# EAGLE design Pow_bank (EAGLE 7.7.0)
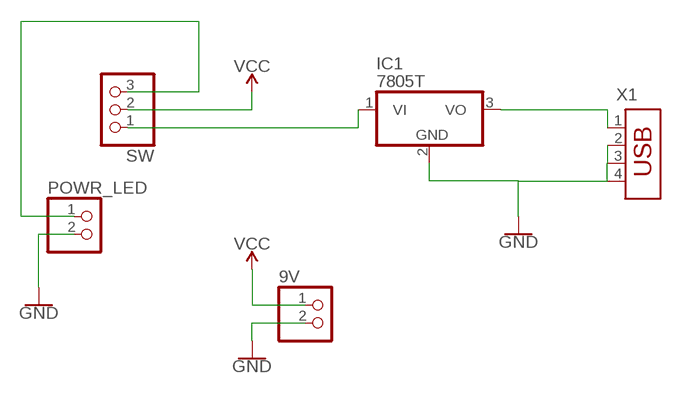
[diagram p0: schematic, sheet 1]

## Parts
9V  PINHD-1X2  [1X02]
IC1  7805T  [TO220H]
POWR_LED  PINHD-1X2  [1X02]
SW  PINHD-1X3  [1X03]
X1  USB-787616  [USB]

## Nets
GND: 9V.2 IC1.2(GND) POWR_LED.2 X1.2 X1.3 X1.4
N$1: IC1.1(VI) SW.1
N$2: IC1.3(VO) X1.1
N$3: POWR_LED.1 SW.3
VCC: 9V.1 SW.2

## Library data of the parts
9V POWR_LED = pinhead:PINHD-1X2: PIN HEADER
IC1 = linear:78*: Positive VOLTAGE REGULATOR Source: http://cache.national.com/ds/LM/LM78L05.pdf http://www.fairchildsemi.com/ds/LM/LM7805.pdf
SW = pinhead:PINHD-1X3: PIN HEADER
X1 = con-amp:USB-787616: AMP connector

## Board
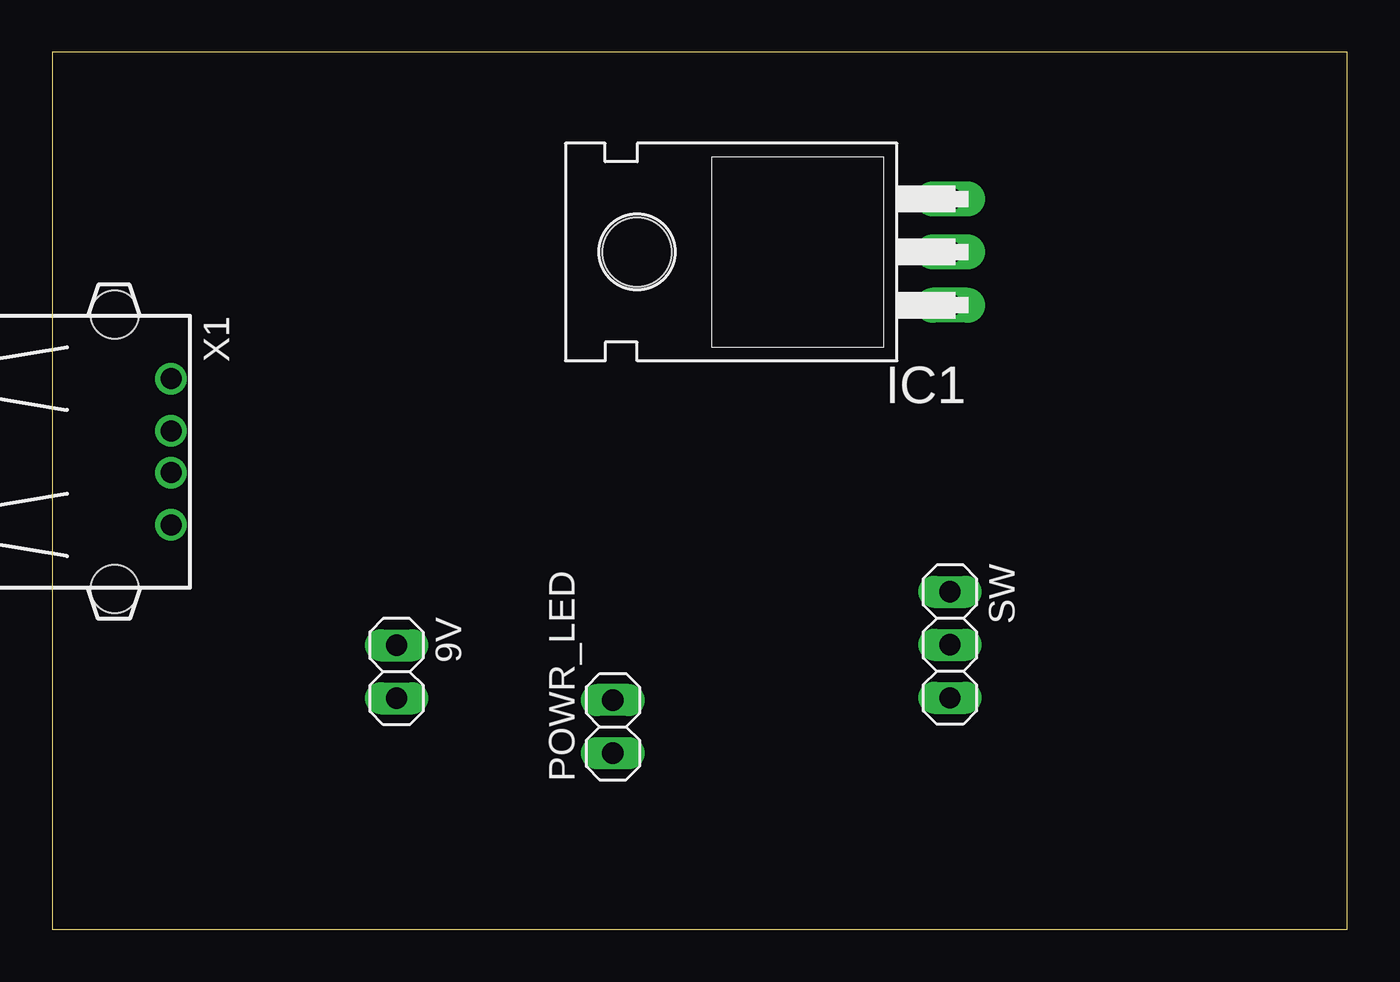
[diagram p1: board, top side]
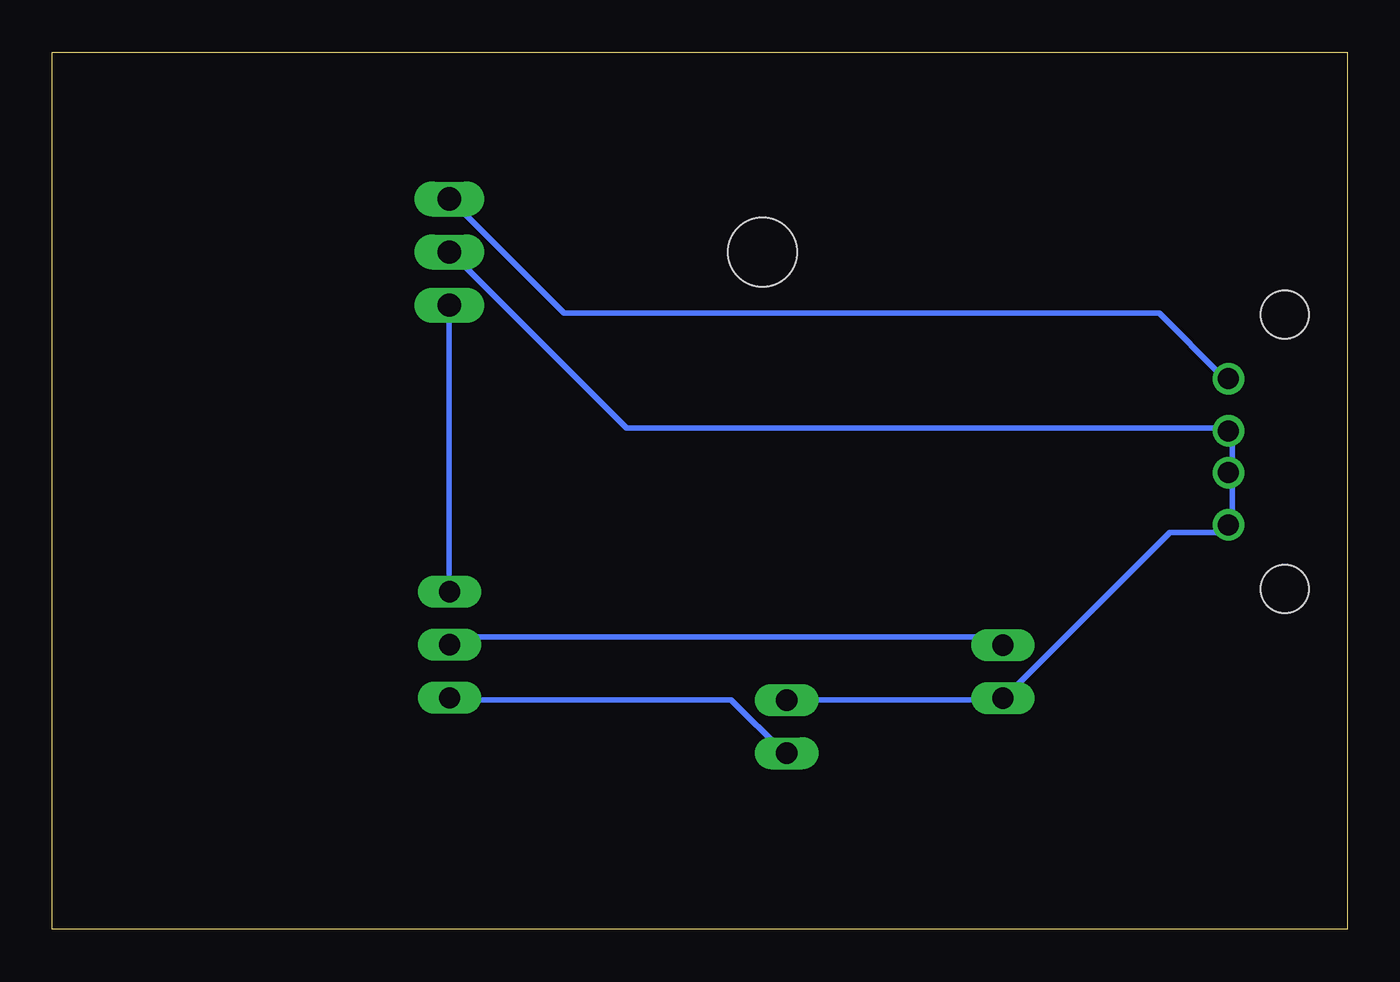
[diagram p2: board, bottom side, seen from below]

Size 62 x 42 mm. Coordinates in mm from the lower left corner, seen from the top.
Outline: 0,0 62,0 62,42 0,42 0,0
Copper layers (1*16): Top 0.035mm / dielectric 1.5mm / Bottom 0.035mm
Design rules "default": minimum track width 10mil, minimum drill 24mil, track to track 8mil, track to pad 8mil, pad to pad 8mil, via to via 8mil, smd to smd 8mil, copper to edge 40mil, drill to drill 8mil, minimum pad ring 10mil, minimum via ring 8mil, stop-mask expansion 4mil, vias tented up to drill 0mil, thermal gap 10mil

### Footprints (pad centres in the part's own frame; a part is rotated, then mirrored left to right if it is on the bottom)
1X02 = drill 1.016 long: 1 -1.27,0; 2 1.27,0
TO220H = drill 1.118 long: 1 -2.54,-10.16; 2 0,-10.16; 3 2.54,-10.16 | hole 3.302: 0,4.826
1X03 = drill 1.016 long: 1 -2.54,0; 2 0,0; 3 2.54,0
USB = drill 1: 1 -3.5,12.99; 2 -1,12.99; 3 1,12.99; 4 3.5,12.99 | hole 2.3: -6.57,10.28; 6.57,10.28

### Placement (x,y rotation side)
9V  16.48,12.34 270 top
IC1  32.82,32.43 90 top
POWR_LED  26.84,9.71 90 top
SW  42.98,13.63 270 top
X1  -7.3,22.87 270 top

### Tracks (layer width: path | path; a pad name or v marks a point on that pad's centre or on a via)
GND
  Bottom 0.254: POWR_LED.2 26.5,11 16.5,11 9V.2 16,11.5 8.5,19 6,19 X1.4 5.5,19.5 5.5,21.5 X1.3 5.5,22 5.5,23.5 X1.2 6,24 34.5,24 42.5,32 IC1.2
N$1
  Bottom 0.254: SW.1 43,16.5 43,29.5 IC1.1
N$2
  Bottom 0.254: X1.1 6,26.5 9,29.5 37.5,29.5 42.5,34.5 IC1.3
N$3
  Bottom 0.254: POWR_LED.1 27,8.5 29.5,11 42.5,11 SW.3
VCC
  Bottom 0.254: 9V.1 16.5,14 42.5,14 SW.2